# Altium schematic sheet Amplify2.SchDoc
size A4; SheetNumber: 3; SheetTotal: 5
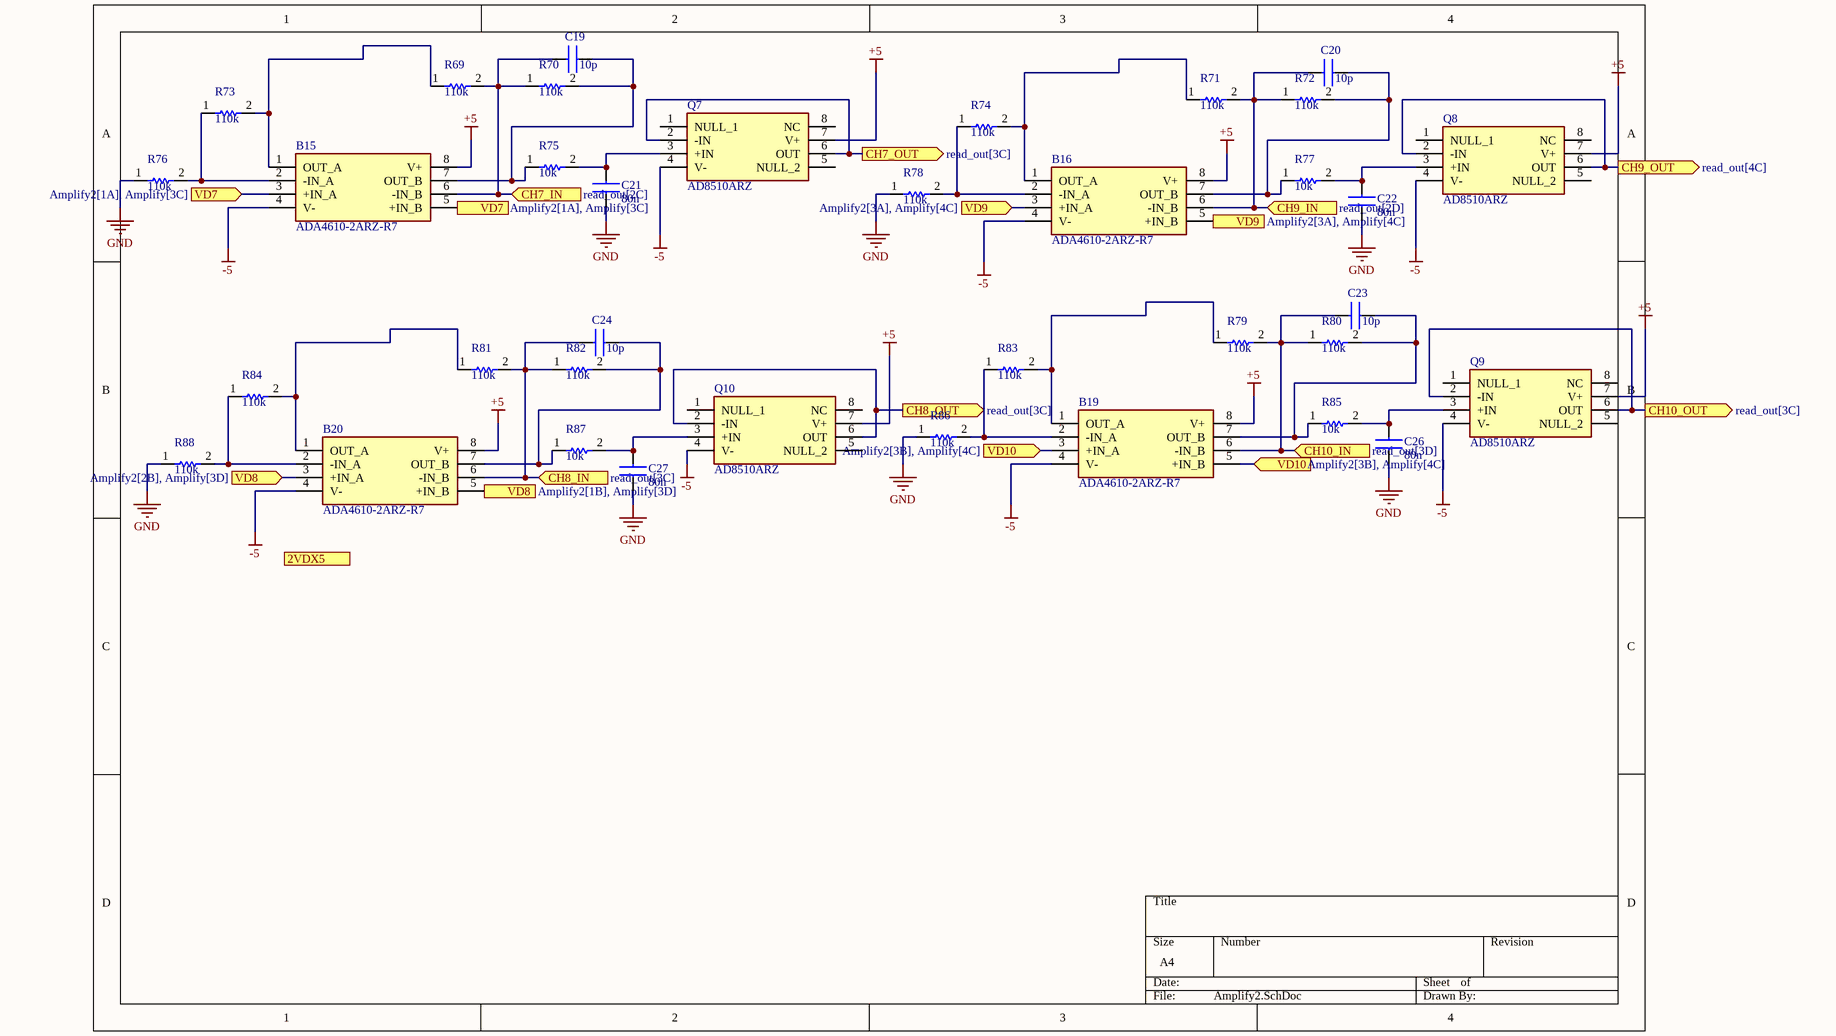
[diagram p0: Amplify2.SchDoc]

## Parts
B15  ADA4610-2ARZ-R7  [SOIC127P600X175-8N]
B16  ADA4610-2ARZ-R7  [SOIC127P600X175-8N]
B19  ADA4610-2ARZ-R7  [SOIC127P600X175-8N]
B20  ADA4610-2ARZ-R7  [SOIC127P600X175-8N]
C19  10p  [0805X7R106KT1AT]
C20  10p  [0805X7R106KT1AT]
C21  80n  [0805X7R106KT1AT]
C22  80n  [0805X7R106KT1AT]
C23  10p  [0805X7R106KT1AT]
C24  10p  [0805X7R106KT1AT]
C26  80n  [0805X7R106KT1AT]
C27  80n  [0805X7R106KT1AT]
Q7  AD8510ARZ  [AD8510ARZ]
Q8  AD8510ARZ  [AD8510ARZ]
Q9  AD8510ARZ  [AD8510ARZ]
Q10  AD8510ARZ  [AD8510ARZ]
R69  110k  [CR0805-FX-1543ELF]
R70  110k  [CR0805-FX-1543ELF]
R71  110k  [CR0805-FX-1543ELF]
R72  110k  [CR0805-FX-1543ELF]
R73  110k  [CR0805-FX-1543ELF]
R74  110k  [CR0805-FX-1543ELF]
R75  10k  [CR0805-FX-1543ELF]
R76  110k  [CR0805-FX-1543ELF]
R77  10k  [CR0805-FX-1543ELF]
R78  110k  [CR0805-FX-1543ELF]
R79  110k  [CR0805-FX-1543ELF]
R80  110k  [CR0805-FX-1543ELF]
R81  110k  [CR0805-FX-1543ELF]
R82  110k  [CR0805-FX-1543ELF]
R83  110k  [CR0805-FX-1543ELF]
R84  110k  [CR0805-FX-1543ELF]
R85  10k  [CR0805-FX-1543ELF]
R86  110k  [CR0805-FX-1543ELF]
R87  10k  [CR0805-FX-1543ELF]
R88  110k  [CR0805-FX-1543ELF]

## Ports
2VDX5 (in), CH7_IN (in, see read_out[2C]), CH7_OUT (out, see read_out[3C]), CH8_IN (in, see read_out[3C]), CH8_OUT (out, see read_out[3C]), CH9_IN (in, see read_out[2D]), CH9_OUT (out, see read_out[4C]), CH10_IN (in, see read_out[3D]), CH10_OUT (out, see read_out[3C]), VD7 (in, see Amplify2[1A], Amplify[3C]), VD8 (in, see Amplify2[1B], Amplify[3D]), VD8 (in, see Amplify2[2B], Amplify[3D]), VD9 (in, see Amplify2[3A], Amplify[4C]), VD10 (in, see Amplify2[3B], Amplify[4C])

## Nets
+5: B15.8(V+) B16.8(V+) B19.8(V+) B20.8(V+) Q7.7(V+) Q8.7(V+) Q9.7(V+) Q10.7(V+)
-5: B15.4(V-) B16.4(V-) B19.4(V-) B20.4(V-) Q7.4(V-) Q8.4(V-) Q9.4(V-) Q10.4(V-)
GND: C21.2 C22.2 C26.2 C27.2 R76.1 R78.1 R86.1 R88.1
CH7_IN: B15.6(-IN_B) C19.1 R69.2 R70.1 ; port CH7_IN
CH7_OUT: Q7.2(-IN) Q7.6(OUT) ; port CH7_OUT
CH8_IN: B20.6(-IN_B) C24.1 R81.2 R82.1 ; port CH8_IN
CH8_OUT: Q10.2(-IN) Q10.6(OUT) ; port CH8_OUT
CH9_IN: B16.6(-IN_B) C20.1 R71.2 R72.1 ; port CH9_IN
CH9_OUT: Q8.2(-IN) Q8.6(OUT) ; port CH9_OUT
CH10_IN: B19.6(-IN_B) C23.1 R79.2 R80.1 ; port CH10_IN
CH10_OUT: Q9.2(-IN) Q9.6(OUT) ; port CH10_OUT
VD7: B15.3(+IN_A) B15.5(+IN_B) ; port VD7
VD8: B20.3(+IN_A) B20.5(+IN_B) ; port VD8
VD9: B16.3(+IN_A) B16.5(+IN_B) ; port VD9
VD10: B19.3(+IN_A) B19.5(+IN_B) ; port VD10
NetB15_1: B15.1(OUT_A) R69.1 R73.2
NetB15_2: B15.2(-IN_A) R73.1 R76.2
NetB15_7: B15.7(OUT_B) C19.2 R70.2 R75.1
NetB16_1: B16.1(OUT_A) R71.1 R74.2
NetB16_2: B16.2(-IN_A) R74.1 R78.2
NetB16_7: B16.7(OUT_B) C20.2 R72.2 R77.1
NetB19_1: B19.1(OUT_A) R79.1 R83.2
NetB19_2: B19.2(-IN_A) R83.1 R86.2
NetB19_7: B19.7(OUT_B) C23.2 R80.2 R85.1
NetB20_1: B20.1(OUT_A) R81.1 R84.2
NetB20_2: B20.2(-IN_A) R84.1 R88.2
NetB20_7: B20.7(OUT_B) C24.2 R82.2 R87.1
NetC21_1: C21.1 Q7.3(+IN) R75.2
NetC22_1: C22.1 Q8.3(+IN) R77.2
NetC26_1: C26.1 Q9.3(+IN) R85.2
NetC27_1: C27.1 Q10.3(+IN) R87.2

Not connected (* = marked no-connect by the designer): Q7 1(NULL_1) 5(NULL_2) 8(NC); Q8 1(NULL_1) 5(NULL_2) 8(NC); Q9 1(NULL_1) 5(NULL_2) 8(NC); Q10 1(NULL_1) 5(NULL_2) 8(NC)

## Library data of the parts
B15 B16 B19 B20 = ADA4610-2ARZ-R7: Low Noise, Precision, Rail-to-Rail Output, JFET Dual Op Amp +/-5 V to +/-15 V 40C to +125C; Manufacturer_Name: Analog Devices; Geometry.Height: 1.75mm; Mouser Part Number: 584-ADA4610-2ARZ-R7; Mouser Price/Stock: https://www.mouser.co.uk/ProductDetail/Analog-Devices/ADA4610-2ARZ-R7?qs=BpaRKvA4VqEBfMREioRxEg%3D%3D; Manufacturer_Part_Number: ADA4610-2ARZ-R7; Datasheet Link: https://www.analog.com/ADA4610-2/datasheet
C19-C24 C26 C27 = capacitor
R69-R88 = resistor